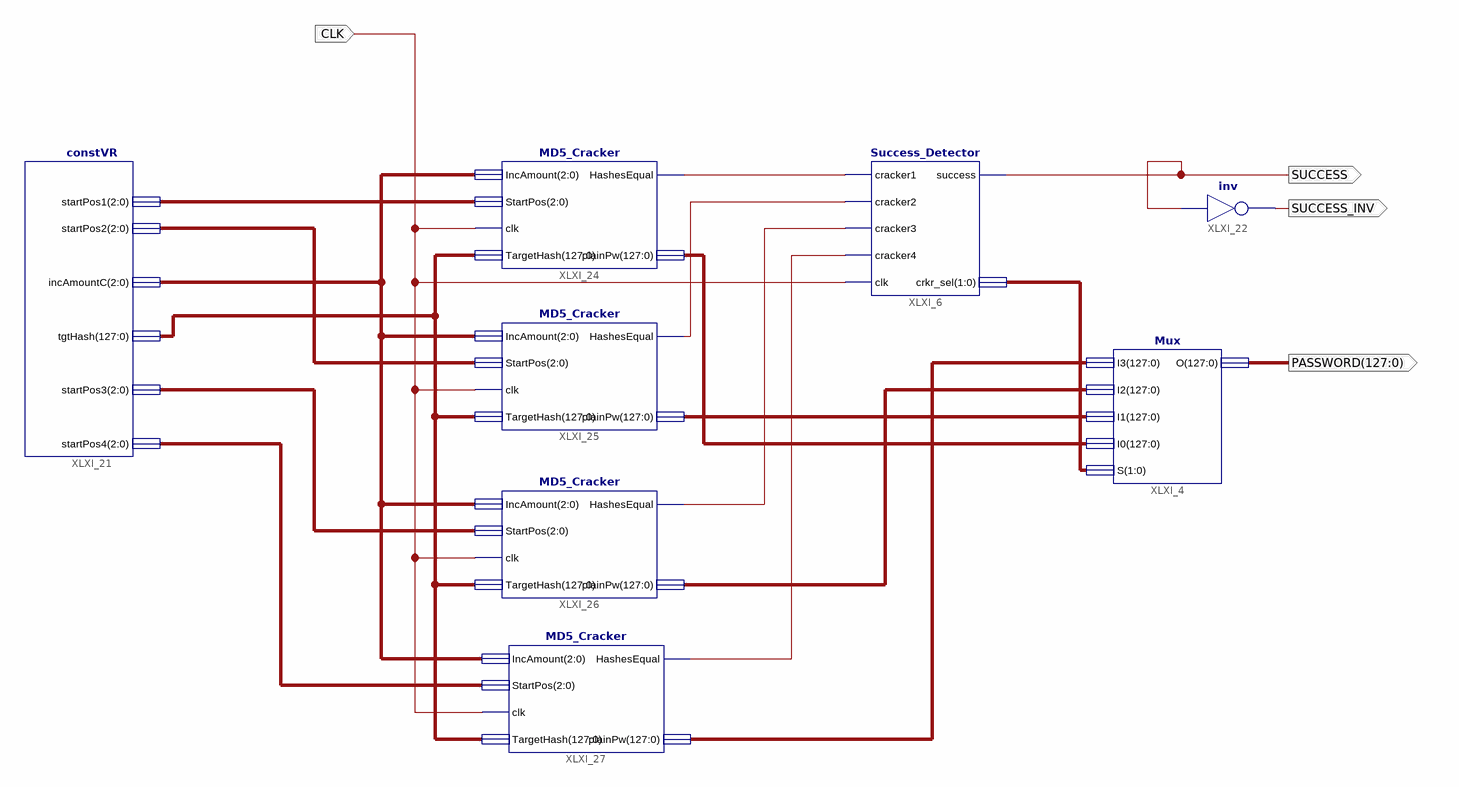
[diagram p0: schematic sheet 1]
// Xilinx ISE schematic Vader.sch (spartan6) as structural Verilog: 8 symbols, 4 ports
module Vader (
  input  CLK,
  output SUCCESS,
  output [127:0] PASSWORD,
  output SUCCESS_INV
);

  wire XLXN_1, XLXN_2, XLXN_60, XLXN_61;
  wire [1:0] XLXN_8;
  wire [2:0] XLXN_18, XLXN_46, XLXN_47, XLXN_48, XLXN_53;
  wire [127:0] XLXN_6, XLXN_7, XLXN_57, XLXN_58, XLXN_59;

  Mux XLXI_4 (.I3(XLXN_59), .I2(XLXN_58), .I1(XLXN_6), .I0(XLXN_7), .S(XLXN_8), .O(PASSWORD));
  Success_Detector XLXI_6 (
    .cracker1(XLXN_1), .cracker2(XLXN_2), .cracker3(XLXN_60), .cracker4(XLXN_61), .clk(CLK),
    .success(SUCCESS), .crkr_sel(XLXN_8));
  constVR XLXI_21 (
    .incAmountC(XLXN_53), .startPos1(XLXN_18), .startPos2(XLXN_46), .tgtHash(XLXN_57), .startPos3(XLXN_47),
    .startPos4(XLXN_48));
  not XLXI_22 (SUCCESS_INV, SUCCESS);
  MD5_Cracker XLXI_24 (
    .IncAmount(XLXN_53), .StartPos(XLXN_18), .clk(CLK), .TargetHash(XLXN_57), .HashesEqual(XLXN_1),
    .plainPw(XLXN_7));
  MD5_Cracker XLXI_25 (
    .IncAmount(XLXN_53), .StartPos(XLXN_46), .clk(CLK), .TargetHash(XLXN_57), .HashesEqual(XLXN_2),
    .plainPw(XLXN_6));
  MD5_Cracker XLXI_26 (
    .IncAmount(XLXN_53), .StartPos(XLXN_47), .clk(CLK), .TargetHash(XLXN_57), .HashesEqual(XLXN_60),
    .plainPw(XLXN_58));
  MD5_Cracker XLXI_27 (
    .IncAmount(XLXN_53), .StartPos(XLXN_48), .clk(CLK), .TargetHash(XLXN_57), .HashesEqual(XLXN_61),
    .plainPw(XLXN_59));
endmodule
